# EAGLE design mainBoardV1 (EAGLE 6.6.0)

## Sheet 1 of 3
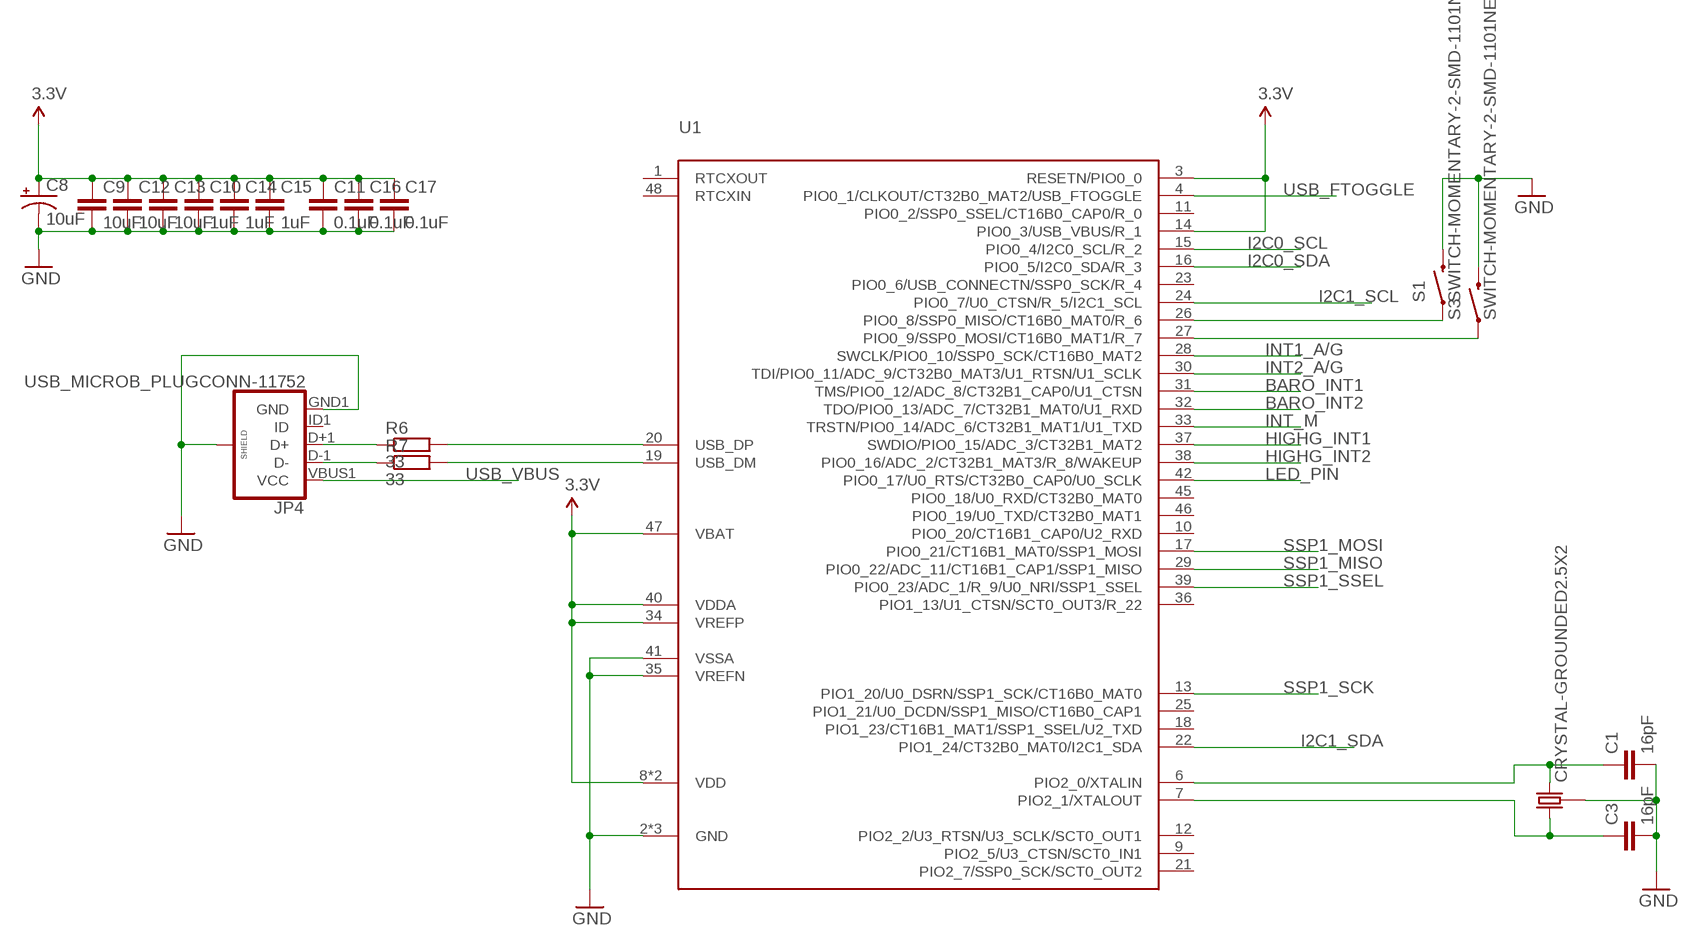
[diagram p0: schematic, sheet 1]

### Parts
C1  16pF  C0402  [C0402]
C3  16pF  C0402  [C0402]
C8  10uF  CPOL1206  [CT3216]
C9  10uF  C0402  [C0402]
C10  1uF  C0402  [C0402]
C11  0.1uF  C0402  [C0402]
C12  10uF  C0402  [C0402]
C13  10uF  C0402  [C0402]
C14  1uF  C0402  [C0402]
C15  1uF  C0402  [C0402]
C16  0.1uF  C0402  [C0402]
C17  0.1uF  C0402  [C0402]
JP4  USB_MICROB_PLUGCONN-11752  [USB-B-MICRO-SMD_V03]
R6  33  R0402  [R0402]
R7  33  R0402  [R0402]
S1  SWITCH-MOMENTARY-2-SMD-1101NE  [TACTILE-SWITCH-1101NE]
S3  SWITCH-MOMENTARY-2-SMD-1101NE  [TACTILE-SWITCH-1101NE]
U1  LPC11U68JBD48  [LQFP48]
U$5  CRYSTAL-GROUNDED2.5X2  [CRYSTAL-SMD-2.5X2]

### Nets
3.3V: C8.A(+) C9.1 C10.1 C11.1 C12.1 C13.1 C14.1 C15.1 C16.1 C17.1 U1.3(RESETN/PIO0_0) U1.8(VDD) U1.14(PIO0_3/USB_VBUS/R_1) U1.34(VREFP) U1.40(VDDA) U1.44(VDD) U1.47(VBAT) ; also sheet 2,3
BARO_INT1: U1.31(TMS/PIO0_12/ADC_8/CT32B1_CAP0/U1_CTSN) ; also sheet 2
BARO_INT2: U1.32(TDO/PIO0_13/ADC_7/CT32B1_MAT0/U1_RXD) ; also sheet 2
GND: C1.2 C3.2 C8.C(-) C9.2 C10.2 C11.2 C12.2 C13.2 C14.2 C15.2 C16.2 C17.2 JP4.GND1(GND) JP4.SHIELD1(SHIELD) JP4.SHIELD2(SHIELD) JP4.SHIELD3(SHIELD) S1.2 S3.2 U1.2(GND) U1.5(GND) U1.35(VREFN) U1.41(VSSA) U1.43(GND) U$5.GND1 U$5.GND2 ; also sheet 2,3
HIGHG_INT1: U1.37(SWDIO/PIO0_15/ADC_3/CT32B1_MAT2) ; also sheet 2
HIGHG_INT2: U1.38(PIO0_16/ADC_2/CT32B1_MAT3/R_8/WAKEUP) ; also sheet 2
I2C0_SCL: U1.15(PIO0_4/I2C0_SCL/R_2) ; also sheet 2
I2C0_SDA: U1.16(PIO0_5/I2C0_SDA/R_3) ; also sheet 2
I2C1_SCL: U1.24(PIO0_7/U0_CTSN/R_5/I2C1_SCL) ; also sheet 2,3
I2C1_SDA: U1.22(PIO1_24/CT32B0_MAT0/I2C1_SDA) ; also sheet 2,3
INT1_A/G: U1.28(SWCLK/PIO0_10/SSP0_SCK/CT16B0_MAT2) ; also sheet 2
INT2_A/G: U1.30(TDI/PIO0_11/ADC_9/CT32B0_MAT3/U1_RTSN/U1_SCLK) ; also sheet 2
INT_M: U1.33(TRSTN/PIO0_14/ADC_6/CT32B1_MAT1/U1_TXD) ; also sheet 2
LED_PIN: U1.42(PIO0_17/U0_RTS/CT32B0_CAP0/U0_SCLK) ; also sheet 3
N$2: C3.1 U1.7(PIO2_1/XTALOUT) U$5.P1
N$3: C1.1 U1.6(PIO2_0/XTALIN) U$5.P2
N$14: R6.2 U1.20(USB_DP)
N$15: JP4.D+1(D+) R6.1
N$16: JP4.D-1(D-) R7.1
N$17: R7.2 U1.19(USB_DM)
N$18: S3.1 U1.27(PIO0_9/SSP0_MOSI/CT16B0_MAT1/R_7)
N$19: S1.1 U1.26(PIO0_8/SSP0_MISO/CT16B0_MAT0/R_6)
SSP1_MISO: U1.29(PIO0_22/ADC_11/CT16B1_CAP1/SSP1_MISO) ; also sheet 3
SSP1_MOSI: U1.17(PIO0_21/CT16B1_MAT0/SSP1_MOSI) ; also sheet 3
SSP1_SCK: U1.13(PIO1_20/U0_DSRN/SSP1_SCK/CT16B0_MAT0) ; also sheet 3
SSP1_SSEL: U1.39(PIO0_23/ADC_1/R_9/U0_NRI/SSP1_SSEL) ; also sheet 3
USB_FTOGGLE: U1.4(PIO0_1/CLKOUT/CT32B0_MAT2/USB_FTOGGLE) ; also sheet 3
USB_VBUS: JP4.VBUS1(VCC) ; also sheet 3
Unconnected: JP4.ID1(ID) U1.1(RTCXOUT) U1.9(PIO2_5/U3_CTSN/SCT0_IN1) U1.10(PIO0_20/CT16B1_CAP0/U2_RXD) U1.11(PIO0_2/SSP0_SSEL/CT16B0_CAP0/R_0) U1.12(PIO2_2/U3_RTSN/U3_SCLK/SCT0_OUT1) U1.18(PIO1_23/CT16B1_MAT1/SSP1_SSEL/U2_TXD) U1.21(PIO2_7/SSP0_SCK/SCT0_OUT2) U1.23(PIO0_6/USB_CONNECTN/SSP0_SCK/R_4) U1.25(PIO1_21/U0_DCDN/SSP1_MISO/CT16B0_CAP1) U1.36(PIO1_13/U1_CTSN/SCT0_OUT3/R_22) U1.45(PIO0_18/U0_RXD/CT32B0_MAT0) U1.46(PIO0_19/U0_TXD/CT32B0_MAT1) U1.48(RTCXIN)

## Sheet 2 of 3
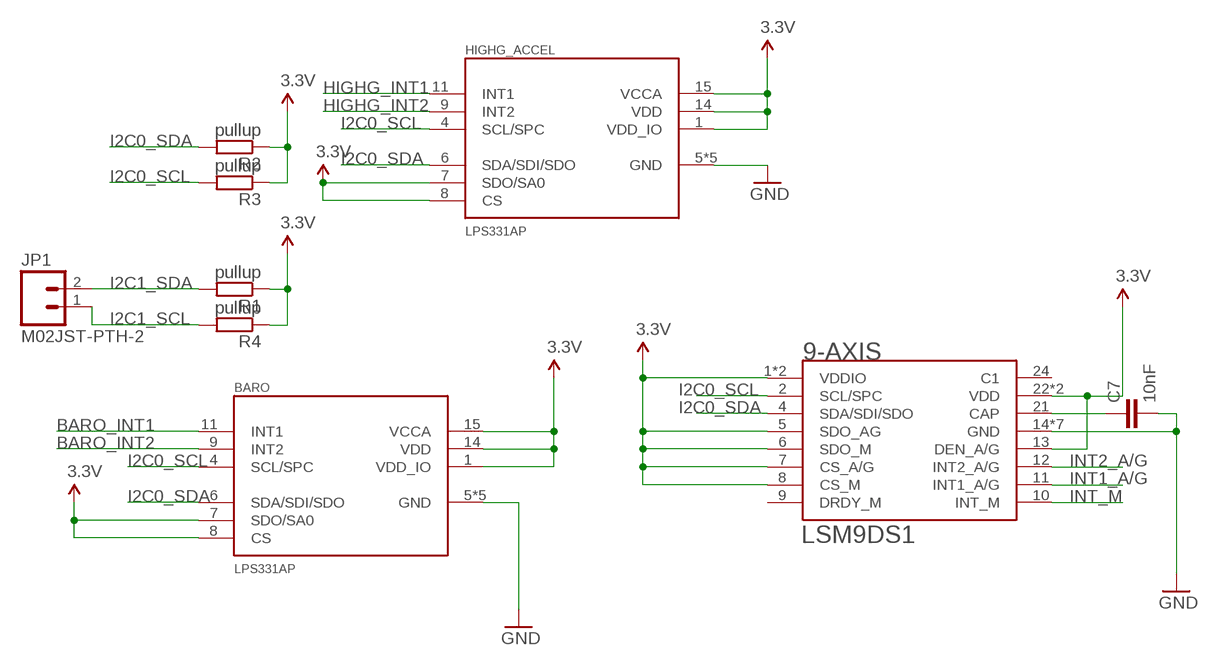
[diagram p1: schematic, sheet 2]

### Parts
9-AXIS  LSM9DS1  [LGA-24L-3.5X3X1]
BARO  LPS331AP  [LGA-16-3X3X1]
C7  10nF  C0402  [C0402]
HIGHG_ACCEL  LPS331AP  [LGA-16-3X3X1]
JP1  M02JST-PTH-2  [JST-2-PTH]
R1  pullup  R0402  [R0402]
R2  pullup  R0402  [R0402]
R3  pullup  R0402  [R0402]
R4  pullup  R0402  [R0402]

### Nets
3.3V: 9-AXIS.1(VDDIO) 9-AXIS.3(VDDIO) 9-AXIS.5(SDO_AG) 9-AXIS.6(SDO_M) 9-AXIS.7(CS_A/G) 9-AXIS.8(CS_M) 9-AXIS.13(DEN_A/G) 9-AXIS.22(VDD) 9-AXIS.23(VDD) BARO.1(VDD_IO) BARO.7(SDO/SA0) BARO.8(CS) BARO.14(VDD) BARO.15(VCCA) HIGHG_ACCEL.1(VDD_IO) HIGHG_ACCEL.7(SDO/SA0) HIGHG_ACCEL.8(CS) HIGHG_ACCEL.14(VDD) HIGHG_ACCEL.15(VCCA) R1.1 R2.1 R3.1 R4.1 ; also sheet 1,3
BARO_INT1: BARO.11(INT1) ; also sheet 1
BARO_INT2: BARO.9(INT2) ; also sheet 1
GND: 9-AXIS.14(GND) 9-AXIS.15(GND) 9-AXIS.16(GND) 9-AXIS.17(GND) 9-AXIS.18(GND) 9-AXIS.19(GND) 9-AXIS.20(GND) BARO.5(GND) BARO.10(GND) BARO.12(GND) BARO.13(GND) BARO.16(GND) C7.2 HIGHG_ACCEL.5(GND) HIGHG_ACCEL.10(GND) HIGHG_ACCEL.12(GND) HIGHG_ACCEL.13(GND) HIGHG_ACCEL.16(GND) ; also sheet 1,3
HIGHG_INT1: HIGHG_ACCEL.11(INT1) ; also sheet 1
HIGHG_INT2: HIGHG_ACCEL.9(INT2) ; also sheet 1
I2C0_SCL: 9-AXIS.2(SCL/SPC) BARO.4(SCL/SPC) HIGHG_ACCEL.4(SCL/SPC) R3.2 ; also sheet 1
I2C0_SDA: 9-AXIS.4(SDA/SDI/SDO) BARO.6(SDA/SDI/SDO) HIGHG_ACCEL.6(SDA/SDI/SDO) R2.2 ; also sheet 1
I2C1_SCL: JP1.1 R4.2 ; also sheet 1,3
I2C1_SDA: JP1.2 R1.2 ; also sheet 1,3
INT1_A/G: 9-AXIS.11(INT1_A/G) ; also sheet 1
INT2_A/G: 9-AXIS.12(INT2_A/G) ; also sheet 1
INT_M: 9-AXIS.10(INT_M) ; also sheet 1
N$11: 9-AXIS.21(CAP) C7.1
Unconnected: 9-AXIS.9(DRDY_M) 9-AXIS.24(C1)

## Sheet 3 of 3
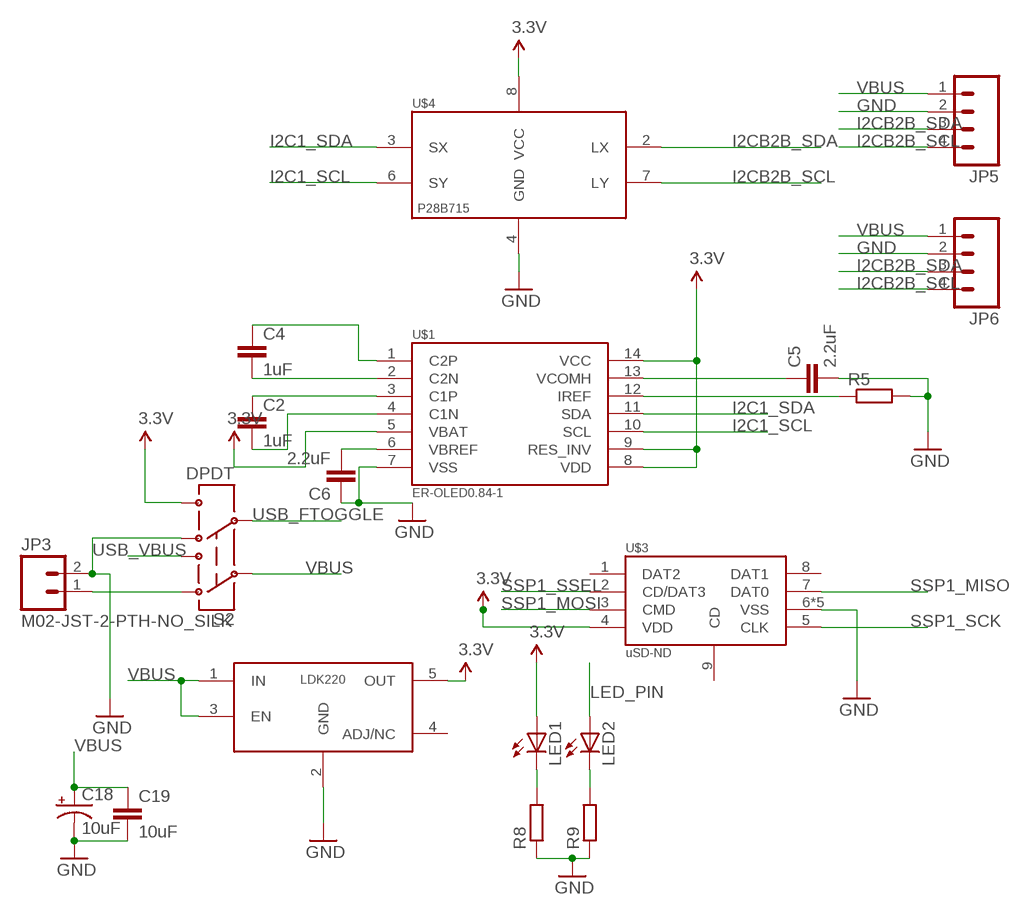
[diagram p2: schematic, sheet 3]

### Parts
C2  1uF  C0402  [C0402]
C4  1uF  C0402  [C0402]
C5  2.2uF  C0402  [C0402]
C6  2.2uF  C0402  [C0402]
C18  10uF  CPOL1206  [CT3216]
C19  10uF  C0402  [C0402]
JP3  M02-JST-2-PTH-NO_SILK  [JST-2-PTH-NS]
JP5  M04JST  [1X04-1.5MM_JST]
JP6  M04JST  [1X04-1.5MM_JST]
LED1  LEDCHIPLED_0603  [CHIPLED_0603]
LED2  LEDCHIPLED_0603  [CHIPLED_0603]
R5  R0402  [R0402]
R8  R0402  [R0402]
R9  R0402  [R0402]
S2  DPDT  SWITCH-DPDTAYZ0202  [AYZ0202]
U$1  ER-OLED0.84-1  [MOLEX_52892-1433]
U$2  LDK220M33R  [SOT23-5]
U$3  MICROSD-CD  [MOLEX_SD-47352-101]
U$4  P82B715  [SO8]

### Nets
3.3V: LED1.A S2.6 U$1.5(VBAT) U$1.8(VDD) U$1.9(RES_INV) U$1.14(VCC) U$2.5(OUT) U$3.4(VDD) U$4.8(VCC) ; also sheet 1,2
GND: C5.2 C6.1 C18.C(-) C19.2 JP3.2 JP5.2 JP6.2 R5.2 R8.1 R9.1 S2.4 U$1.7(VSS) U$2.2(GND) U$3.6(VSS) U$3.G1(VSS) U$3.G2(VSS) U$3.G3(VSS) U$3.G4(VSS) U$4.4(GND) ; also sheet 1,2
I2C1_SCL: U$1.10(SCL) U$4.6(SY) ; also sheet 1,2
I2C1_SDA: U$1.11(SDA) U$4.3(SX) ; also sheet 1,2
I2CB2B_SCL: JP5.4 JP6.4 U$4.7(LY)
I2CB2B_SDA: JP5.3 JP6.3 U$4.2(LX)
LED_PIN: LED2.A ; also sheet 1
N$1: JP3.1 S2.1
N$4: LED1.C R8.2
N$5: LED2.C R9.2
N$6: C4.1 U$1.1(C2P)
N$7: C4.2 U$1.2(C2N)
N$8: C2.1 U$1.3(C1P)
N$9: C2.2 U$1.4(C1N)
N$10: C5.1 U$1.13(VCOMH)
N$12: R5.1 U$1.12(IREF)
N$13: C6.2 U$1.6(VBREF)
SSP1_MISO: U$3.7(DAT0) ; also sheet 1
SSP1_MOSI: U$3.3(CMD) ; also sheet 1
SSP1_SCK: U$3.5(CLK) ; also sheet 1
SSP1_SSEL: U$3.2(CD/DAT3) ; also sheet 1
USB_FTOGGLE: S2.5 ; also sheet 1
USB_VBUS: S2.3 ; also sheet 1
VBUS: C18.A(+) C19.1 JP5.1 JP6.1 S2.2 U$2.1(IN) U$2.3(EN)
Unconnected: U$2.4(ADJ/NC) U$3.1(DAT2) U$3.8(DAT1) U$3.9(CD)

## Library data of the parts
9-AXIS = Sensors:LSM9DS1
BARO HIGHG_ACCEL = Sensors:LPS331AP
C1-C7 C9-C17 C19 = ELL-i-Passives:C: Surface Mount Capasitors — in standard sizes A capacitor used to store energy electrostatically in an electric field. If you need a high-value capacitor, consider using a polarised capacitor to save space. Wikipedia article on capacitors <https://en.wikipedia.org/wiki/Capacitor>
C8 C18 = ELL-i-Passives:CPOL: Polarized Capacitor — common SMD and some through-hole ones A capacitor used to store energy electrostatically in an electric field. If you need a high-value capacitor, consider using a polarised capacitor to save space. Wikipedia article on capacitors <https://en.wikipedia.org/wiki/Capacitor> These are standard surface mount (SMD) and through-hole (PTH) capacitors. Normally 10uF, 47uF, and 100uF in electrolytic and tantalum varieties. Always verify the external diameter of the through hole cap, it varies with capacity, voltage, and manufacturer. The EIA tantalum devices should have standard packages. Copied from SparkFun-Passives.lbr under SparkFun Creative Commons license. Adopted to EagleUp usage through renaming the packages appropriately.
JP1 = SparkFun-Connectors:M02: Standard 2-pin 0.1" header. Use with - straight break away headers ( PRT-00116) - right angle break away headers (PRT-00553) - swiss pins (PRT-00743) - machine pins (PRT-00117) - female headers (PRT-00115) Molex polarized connector foot print use with: PRT-08233 with associated crimp pins and housings. 2.54_SCREWTERM for use with PRT-10571. 3.5mm Screw Terminal footprints for PRT-08084 5mm Screw Terminal footprints for use with PRT-08432; SKU: PRT-09914
JP3 = SparkFun-Connectors:M02: Standard 2-pin 0.1" header. Use with - straight break away headers ( PRT-00116) - right angle break away headers (PRT-00553) - swiss pins (PRT-00743) - machine pins (PRT-00117) - female headers (PRT-00115) Molex polarized connector foot print use with: PRT-08233 with associated crimp pins and housings. 2.54_SCREWTERM for use with PRT-10571. 3.5mm Screw Terminal footprints for PRT-08084 5mm Screw Terminal footprints for use with PRT-08432
JP4 = SparkFun-Connectors:USB_MICROB_PLUG: USB Micro-B connectors Some male, some female. Watch your step!; PROD_ID: CONN-11752
JP5 JP6 = SparkFun-Connectors:M04: Header 4 Standard 4-pin 0.1" header. Use with straight break away headers (SKU : PRT-00116), right angle break away headers (PRT-00553), swiss pins (PRT-00743), machine pins (PRT-00117), and female headers (PRT-00115). Molex polarized connector foot print use with SKU : PRT-08231 with associated crimp pins and housings. 1MM SMD Version SKU: PRT-10208
LED1 LED2 = adafruit:LED: LED OSRAM: - CHIPLED LG R971, LG N971, LY N971, LG Q971, LY Q971, LO R971, LY R971 LH N974, LH R974 LS Q976, LO Q976, LY Q976 LO Q996 - Hyper CHIPLED LW Q18S LB Q993, LB Q99A, LB R99A - SideLED LS A670, LO A670, LY A670, LG A670, LP A670 LB A673, LV A673, LT A673, LW A673 LH A674 LY A675 LS A676, LA A676, LO A676, LY A676, LW A676 LS A679, LY A679, LG A679 - Hyper Micro SIDELED® LS Y876, LA Y876, LO Y876, LY Y876 LT Y87S - SmartLED LW L88C, LW L88S LB L89C, LB L89S, LG L890 LS L89K, LO L89K, LY L89K LS L896, LA L896, LO L896, LY L896 - TOPLED LS T670, LO T670, LY T670, LG T670, LP T670 LSG T670, LSP T670, LSY T670, LOP T670, LYG T670 LG T671, LOG T671, LSG T671 LB T673, LV T673, LT T673, LW T673 LH T674 LS T676, LA T676, LO T676, LY T676, LB T676, LH T676, LSB T676, LW T676 LB T67C, LV T67C, LT T67C, LS T67K, LO T67K, LY T67K, LW E67C LS E67B, LA E67B, LO E67B, LY E67B, LB E67C, LV E67C, LT E67C LW T67C LS T679, LY T679, LG T679 LS T770, LO T770, LY T770, LG T770, LP T770 LB T773, LV T773, LT T773, LW T773 LH T774 LS E675, LA E675, LY E675, LS T675 LS T776, LA T776, LO T776, LY T776, LB T776 LHGB T686 LT T68C, LB T68C - Hyper Mini TOPLED® LB M676 - Mini TOPLED Santana® LG M470 LS M47K, LO M47K, LY M47K Source: http://www.osram.convergy.de/
R1-R9 = ELL-i-Passives:R: Surface Mount Resistor — in standard sizes
S1 S3 = SparkFun-Electromechanical:SWITCH-MOMENTARY-2: Various NO switches- pushbuttons, reed, etc
S2 = SparkFun-Electromechanical:SWITCH-DPDT: DPDT Version of the COM-00597; PROD_ID: SWCH-08179
U1 = LPC11U68:LPC11U68JBD48
U$1 = Sensors:ER-OLED0.84-1
U$2 = Sensors:LDK220M33R
U$3 = Sensors:MICROSD-CD
U$4 = Sensors:P82B715
U$5 = SparkFun-FreqCtrl:CRYSTAL-GROUNDED

## Board
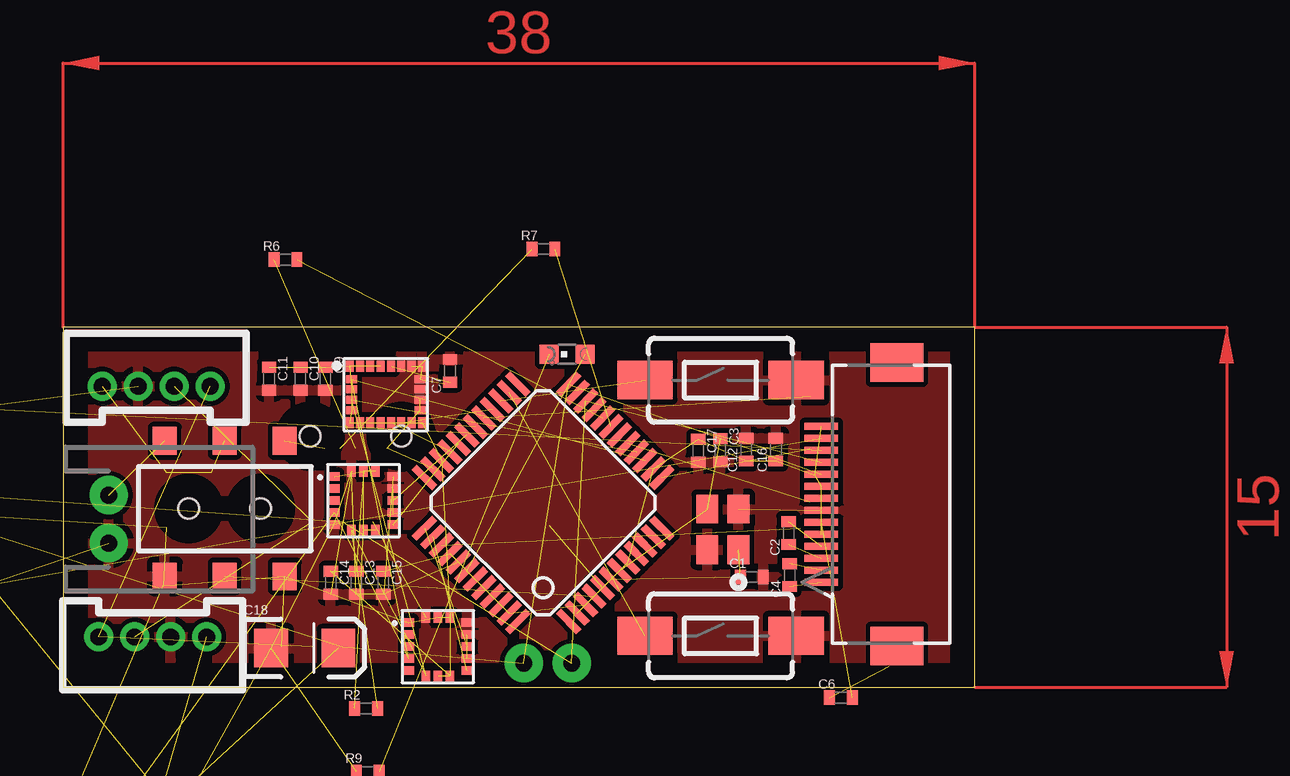
[diagram p3: board, top side]
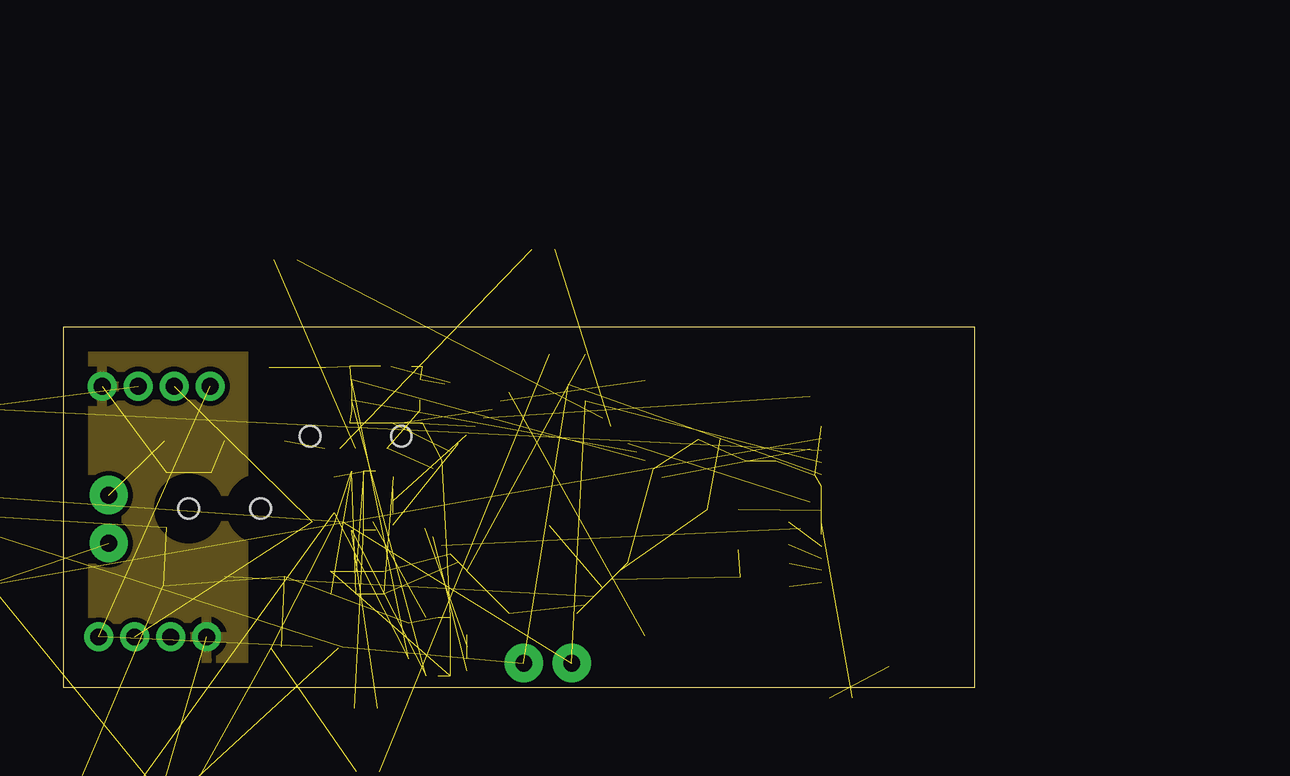
[diagram p4: board, inner layer Route2]
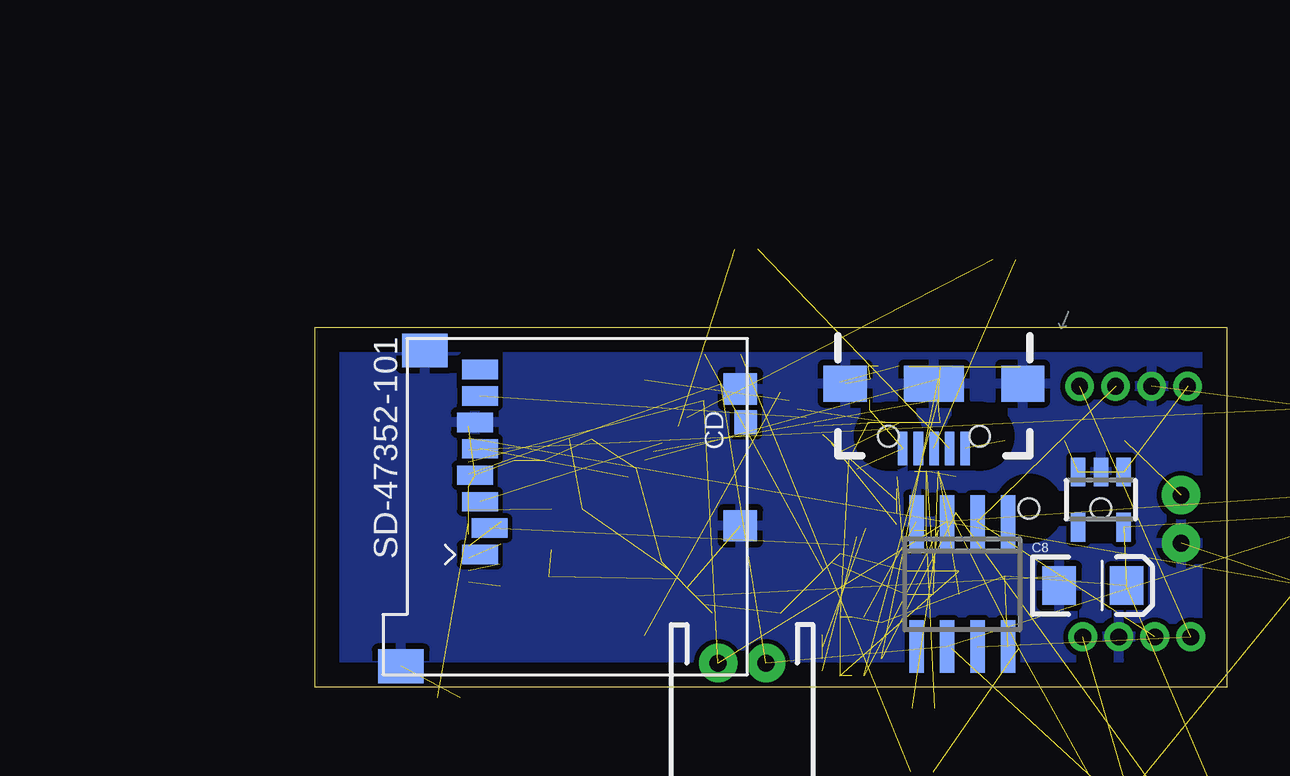
[diagram p5: board, bottom side, seen from below]

Size 38 x 15 mm. Coordinates in mm from the lower left corner, seen from the top.
Outline: 0,0 38,0 38,15 0,15 0,0
Copper layers (1*2*15*16): Top 0.035mm / dielectric 0.2mm / Route2 0.035mm / dielectric 0.15mm / Route15 0.035mm / dielectric 0.2mm / Bottom 0.035mm
Design rules "default *": minimum track width 10mil, minimum drill 24mil, track to track 8mil, track to pad 8mil, pad to pad 8mil, via to via 8mil, smd to smd 8mil, copper to edge 40mil, drill to drill 8mil, minimum pad ring 10mil, minimum via ring 8mil, stop-mask expansion 4mil, vias tented up to drill 0mil, thermal gap 10mil

### Footprints (pad centres in the part's own frame; a part is rotated, then mirrored left to right if it is on the bottom)
LGA-24L-3.5X3X1 = smd 0.33 x 0.45: 1 0.245,2.675; 6 0.245,0.325; 7 0.675,0.325; 8 1.105,0.325; 9 1.535,0.325; 10 1.965,0.325; 11 2.395,0.325; 12 2.825,0.325; 13 3.255,0.325; 18 3.255,2.675; 19 2.825,2.675; 20 2.395,2.675; 21 1.965,2.675; 22 1.535,2.675; 23 1.105,2.675; 24 0.675,2.675 | smd 0.45 x 0.33: 2 0.325,2.145; 3 0.325,1.715; 4 0.325,1.285; 5 0.325,0.855; 14 3.175,0.855; 15 3.175,1.285; 16 3.175,1.715; 17 3.175,2.145
LGA-16-3X3X1 = smd 0.45 x 0.35: 1 0.275,2.5; 2 0.275,2; 3 0.275,1.5; 4 0.275,1; 5 0.275,0.5; 9 2.725,0.5; 10 2.725,1; 11 2.725,1.5; 12 2.725,2; 13 2.725,2.5 | smd 0.35 x 0.45: 6 1,0.275; 7 1.5,0.275; 8 2,0.275; 14 2,2.725; 15 1.5,2.725; 16 1,2.725
C0402 = smd 0.45 x 0.6: 1 -0.475,0; 2 0.475,0
CT3216 = smd 1.4 x 1.6: A 1.4,0; C -1.4,0
JST-2-PTH = drill 0.7 pad 1.6: 1 -1,0; 2 1,0
JST-2-PTH-NS = drill 0.7 pad 1.6: 1 -1,0; 2 1,0
USB-B-MICRO-SMD_V03 = smd 1.4 x 0.4: D+1 2.7,0; D-1 2.7,0.65; GND1 2.7,-1.3; ID1 2.7,-0.65; VBUS1 2.7,1.3 | smd 1.5 x 1.8: SHIELD1 0,3.7; SHIELD2 0,-3.7 | smd 1.5 x 2.5: SHIELD3 0,0 | hole 0.85: 2.2,1.9; 2.2,-1.9
1X04-1.5MM_JST = drill 0.7: 1 0,0; 2 1.5,0; 3 3,0; 4 4.5,0
CHIPLED_0603 = smd 0.8 x 0.8: A 0,-0.75; C 0,0.75
R0402 = smd 0.45 x 0.6: 1 -0.475,0; 2 0.475,0
TACTILE-SWITCH-1101NE = smd 2.3 x 1.6: 1 -3.15,0; 2 3.15,0
AYZ0202 = smd 1 x 1.15: 1 -2.5,2.825; 2 0,2.825; 3 2.5,2.825; 4 -2.5,-2.825; 5 0,-2.825; 6 2.5,-2.825 | hole 0.85: 1.5,0; -1.5,0
LQFP48 = smd 0.3 x 1.2: 1 -2.75,-4.25; 2 -2.25,-4.25; 3 -1.75,-4.25; 4 -1.25,-4.25; 5 -0.75,-4.25; 6 -0.25,-4.25; 7 0.25,-4.25; 8 0.75,-4.25; 9 1.25,-4.25; 10 1.75,-4.25; 11 2.25,-4.25; 12 2.75,-4.25; 25 2.75,4.25; 26 2.25,4.25; 27 1.75,4.25; 28 1.25,4.25; 29 0.75,4.25; 30 0.25,4.25; 31 -0.25,4.25; 32 -0.75,4.25; 33 -1.25,4.25; 34 -1.75,4.25; 35 -2.25,4.25; 36 -2.75,4.25 | smd 1.2 x 0.3: 13 4.25,-2.75; 14 4.25,-2.25; 15 4.25,-1.75; 16 4.25,-1.25; 17 4.25,-0.75; 18 4.25,-0.25; 19 4.25,0.25; 20 4.25,0.75; 21 4.25,1.25; 22 4.25,1.75; 23 4.25,2.25; 24 4.25,2.75; 37 -4.25,2.75; 38 -4.25,2.25; 39 -4.25,1.75; 40 -4.25,1.25; 41 -4.25,0.75; 42 -4.25,0.25; 43 -4.25,-0.25; 44 -4.25,-0.75; 45 -4.25,-1.25; 46 -4.25,-1.75; 47 -4.25,-2.25; 48 -4.25,-2.75
MOLEX_52892-1433 = smd 0.3 x 1.4: 1 3.25,2.896; 2 2.75,2.896; 3 2.25,2.896; 4 1.75,2.896; 5 1.25,2.896; 6 0.75,2.896; 7 0.25,2.896; 8 -0.25,2.896; 9 -0.75,2.896; 10 -1.25,2.896; 11 -1.75,2.896; 12 -2.25,2.896; 13 -2.75,2.896; 14 -3.25,2.896 | smd 1.6 x 2.2: LFIT -5.9,6.046; RFIT 5.9,6.046
SOT23-5 = smd 0.6 x 1.2: 1 -0.95,-1.15; 2 0,-1.15; 3 0.95,-1.15; 4 0.95,1.15; 5 -0.95,1.15
MOLEX_SD-47352-101 = smd 0.8 x 1.5: 1 9.19,3.24; 2 8.09,3.64; 3 6.99,3.24; 4 5.89,3.04; 5 4.79,3.24; 6 3.69,3.04; 7 2.59,3.24; 8 1.49,3.24 | smd 1 x 0.95: 9 3.69,14.325 | smd 1.4 x 1.9: G1 13.85,-0.05; G4 0.7,0.95 | smd 1.3 x 1.4: G2 8,14.1; G3 2.3,14.1
SO8 = smd 0.6 x 2.2: 1 -1.905,-2.6; 2 -0.635,-2.6; 3 0.635,-2.6; 4 1.905,-2.6; 5 1.905,2.6; 6 0.635,2.6; 7 -0.635,2.6; 8 -1.905,2.6
CRYSTAL-SMD-2.5X2 = smd 1.2 x 0.9: GND1 0.6,1.8; GND2 2.3,0.5; P1 2.3,1.8; P2 0.6,0.5

### Placement (x,y rotation side)
9-AXIS  11.7,10.69 0 top
BARO  11.02,6.27 0 top
C1  28.71,4.59 0 top
C2  30.24,6.42 90 top
C3  27.4,9.87 270 top
C4  30.28,4.67 90 top
C5  -4.83,3.87 0 top  (outside the outline)
C6  32.42,-0.44 0 top
C7  16.13,13.18 90 top
C8  5.58,4.23 0 bottom
C9  10.94,12.85 270 top
C10  9.9,12.85 270 top
C11  8.59,12.85 270 top
C12  28.47,9.9 90 top
C13  12.22,4.35 270 top
C14  11.16,4.35 270 top
C15  13.35,4.35 270 top
C16  29.71,9.9 90 top
C17  26.48,9.85 270 top
C18  10.07,1.63 0 top
C19  4.28,-5.43 0 top  (outside the outline)
HIGHG_ACCEL  14.12,0.19 0 top
JP1  20.2,1 180 bottom
JP3  1.9,7 270 top
JP4  12.2,12.65 270 bottom
JP5  1.63,12.54 0 top
JP6  5.99,2.09 180 top
LED1  -6.8,8.09 0 top  (outside the outline)
LED2  21.01,13.87 90 top
R1  -13.13,8.17 90 top  (outside the outline)
R2  12.63,-0.89 0 top
R3  -1.02,-9.1 0 top  (outside the outline)
R4  -10.07,8.17 90 top  (outside the outline)
R5  -4.08,11.66 0 top  (outside the outline)
R6  9.27,17.81 0 top
R7  20.02,18.25 0 top  (outside the outline)
R8  7.7,-9.49 0 top  (outside the outline)
R9  12.7,-3.53 0 top  (outside the outline)
S1  27.41,2.14 0 top
S2  6.74,7.44 0 top
S3  27.41,12.79 0 top
U1  20.01,7.68 45 top
U$1  28.71,7.62 270 top
U$2  5.24,7.81 180 bottom
U$3  34.37,14.72 270 bottom
U$4  11.02,4.29 180 bottom
U$5  28.65,5.12 90 top

### Tracks (layer width: path | path; a pad name or v marks a point on that pad's centre or on a via)
3.3V  (48 unrouted)
BARO_INT1  (1 unrouted)
BARO_INT2  (1 unrouted)
GND  (26 unrouted)
  pour Bottom: 0,0 38,0 38,15 0,15
  pour Top: 0,15 38,15 38,0 0,0
HIGHG_INT1  (1 unrouted)
HIGHG_INT2  (1 unrouted)
I2C0_SCL  (4 unrouted)
I2C0_SDA  (4 unrouted)
I2C1_SCL  (4 unrouted)
I2C1_SDA  (4 unrouted)
I2CB2B_SCL  (2 unrouted)
I2CB2B_SDA  (2 unrouted)
INT1_A/G  (1 unrouted)
INT2_A/G  (1 unrouted)
INT_M  (1 unrouted)
LED_PIN  (1 unrouted)
N$1  (1 unrouted)
N$2  (2 unrouted)
N$3  (2 unrouted)
N$4  (1 unrouted)
N$5  (1 unrouted)
N$6  (1 unrouted)
N$7  (1 unrouted)
N$8  (1 unrouted)
N$9  (1 unrouted)
N$10  (1 unrouted)
N$11  (1 unrouted)
N$12  (1 unrouted)
N$13  (1 unrouted)
N$14  (1 unrouted)
N$15  (1 unrouted)
N$16  (1 unrouted)
N$17  (1 unrouted)
N$18  (1 unrouted)
N$19  (1 unrouted)
SSP1_MISO  (1 unrouted)
SSP1_MOSI  (1 unrouted)
SSP1_SCK  (1 unrouted)
SSP1_SSEL  (1 unrouted)
USB_FTOGGLE  (1 unrouted)
USB_VBUS  (1 unrouted)
VBUS  (5 unrouted)
  pour Route2: 0.25,14.75 7.5,14.75 7.5,0.25 0.25,0.25
(copper drawn outside any net)
  shapes: Top area x2